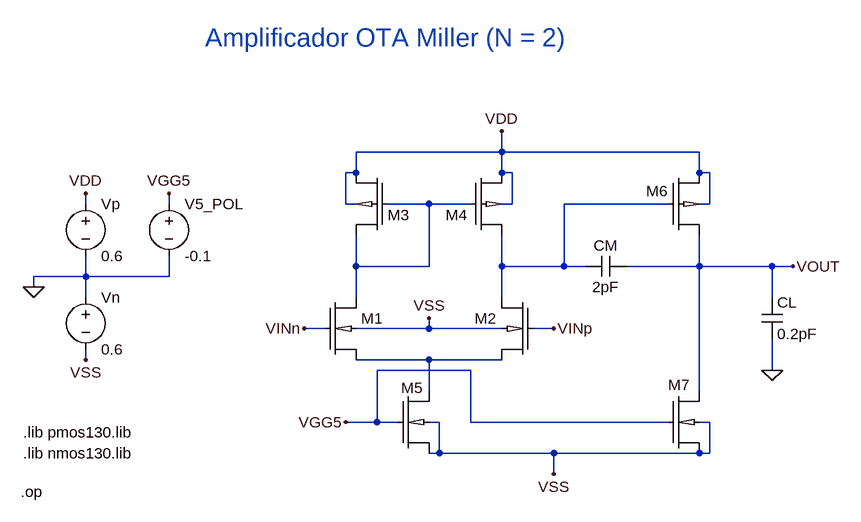
[diagram p0: schematic Amp_OTAMiller_N_2.asc]
Amp_OTAMiller_N_2.asc, the LTspice schematic file:
Version 4.1
SHEET 1 1192 680
WIRE 608 -272 608 -304
WIRE 608 -272 384 -272
WIRE 912 -272 608 -272
WIRE 384 -240 384 -272
WIRE 384 -240 368 -240
WIRE 608 -240 608 -272
WIRE 624 -240 608 -240
WIRE 912 -240 912 -272
WIRE 928 -240 912 -240
WIRE -32 -192 -32 -208
WIRE 96 -192 96 -208
WIRE 368 -192 368 -240
WIRE 384 -192 368 -192
WIRE 496 -192 432 -192
WIRE 560 -192 496 -192
WIRE 624 -192 624 -240
WIRE 624 -192 608 -192
WIRE 864 -192 704 -192
WIRE 928 -192 928 -240
WIRE 928 -192 912 -192
WIRE 384 -96 384 -144
WIRE 496 -96 496 -192
WIRE 496 -96 384 -96
WIRE 608 -96 608 -144
WIRE 704 -96 704 -192
WIRE 704 -96 608 -96
WIRE 736 -96 704 -96
WIRE 912 -96 912 -144
WIRE 912 -96 800 -96
WIRE 1024 -96 912 -96
WIRE 1056 -96 1024 -96
WIRE -32 -80 -32 -112
WIRE -32 -80 -112 -80
WIRE 96 -80 96 -112
WIRE 96 -80 -32 -80
WIRE -112 -64 -112 -80
WIRE -32 -48 -32 -80
WIRE 384 -48 384 -96
WIRE 608 -48 608 -96
WIRE 1024 -48 1024 -96
WIRE 336 0 304 0
WIRE 496 0 496 -16
WIRE 496 0 384 0
WIRE 608 0 496 0
WIRE 688 0 656 0
WIRE -32 48 -32 32
WIRE 496 48 384 48
WIRE 608 48 496 48
WIRE 560 64 416 64
WIRE 1024 64 1024 16
WIRE 496 96 496 48
WIRE 912 96 912 -96
WIRE 416 144 416 64
WIRE 416 144 368 144
WIRE 448 144 416 144
WIRE 512 144 496 144
WIRE 560 144 560 64
WIRE 864 144 560 144
WIRE 928 144 912 144
WIRE 512 192 512 144
WIRE 512 192 496 192
WIRE 688 192 512 192
WIRE 912 192 688 192
WIRE 928 192 928 144
WIRE 928 192 912 192
WIRE 688 224 688 192
FLAG -112 -64 0
FLAG -32 48 VSS
FLAG -32 -208 VDD
FLAG 1024 64 0
FLAG 608 -304 VDD
FLAG 688 224 VSS
FLAG 1056 -96 VOUT
FLAG 688 0 VINp
FLAG 304 0 VINn
FLAG 368 144 VGG5
FLAG 96 -208 VGG5
FLAG 496 -16 VSS
SYMBOL voltage -32 -208 R0
WINDOW 123 0 0 Left 0
WINDOW 39 0 0 Left 0
SYMATTR InstName Vp
SYMATTR Value 0.6
SYMBOL voltage -32 -64 R0
WINDOW 123 0 0 Left 0
WINDOW 39 0 0 Left 0
SYMATTR InstName Vn
SYMATTR Value 0.6
SYMBOL nmos130 336 -48 R0
WINDOW 3 56 72 Invisible 2
SYMATTR InstName M1
SYMATTR SpiceLine width=10u length=2u
SYMBOL nmos130 656 -48 M0
WINDOW 3 56 72 Invisible 2
SYMATTR InstName M2
SYMATTR SpiceLine width=10u length=2u
SYMBOL pmos130 432 -144 R180
WINDOW 0 -34 31 Left 2
WINDOW 3 56 72 Invisible 2
SYMATTR InstName M3
SYMATTR SpiceLine width=20u length=2u
SYMBOL pmos130 560 -144 M180
WINDOW 0 -38 31 Left 2
WINDOW 3 56 72 Invisible 2
SYMATTR InstName M4
SYMATTR SpiceLine width=20u length=2u
SYMBOL nmos130 448 96 R0
WINDOW 0 5 -5 Left 2
WINDOW 3 56 72 Invisible 2
SYMATTR InstName M5
SYMATTR SpiceLine width=1u length=1u
SYMBOL pmos130 864 -144 M180
WINDOW 0 -34 68 Left 2
WINDOW 3 56 72 Invisible 2
SYMATTR InstName M6
SYMATTR SpiceLine width=80u length=500n
SYMBOL nmos130 864 96 R0
WINDOW 0 0 -9 Left 2
WINDOW 3 56 72 Invisible 2
SYMATTR InstName M7
SYMATTR SpiceLine width=40u length=20u
SYMBOL cap 800 -112 R90
WINDOW 0 0 32 VBottom 2
WINDOW 3 32 32 VTop 2
SYMATTR InstName CM
SYMATTR Value 2pF
SYMBOL cap 1008 -48 R0
SYMATTR InstName CL
SYMATTR Value 0.2pF
SYMBOL voltage 96 -208 R0
WINDOW 123 0 0 Left 0
WINDOW 39 0 0 Left 0
SYMATTR InstName V5_POL
SYMATTR Value -0.1
TEXT -128 160 Left 2 !.lib pmos130.lib
TEXT -128 192 Left 2 !.lib nmos130.lib
TEXT 152 -448 Left 4 ;Amplificador OTA Miller (N = 2)
TEXT -132 251 Left 2 !.op

The netlist it stands for:
* Amp_OTAMiller_N_2.asc
Vp VDD 0 0.6
Vn 0 VSS 0.6
X§M1 N001 VINn N003 VSS nmos130 width=10u length=2u  ; pins D G S B
X§M2 N002 VINp N003 VSS nmos130 width=10u length=2u  ; pins D G S B
X§M3 N001 N001 VDD VDD pmos130 width=20u length=2u  ; pins D G S B
X§M4 N002 N001 VDD VDD pmos130 width=20u length=2u  ; pins D G S B
X§M5 N003 VGG5 VSS VSS nmos130 width=1u length=1u  ; pins D G S B
X§M6 VOUT N002 VDD VDD pmos130 width=80u length=500n  ; pins D G S B
X§M7 VOUT VGG5 VSS VSS nmos130 width=40u length=20u  ; pins D G S B
CM VOUT N002 2pF
CL VOUT 0 0.2pF
V5_POL VGG5 0 -0.1
.lib pmos130.lib
.lib nmos130.lib
* Amplificador OTA Miller (N = 2)
.op
.backanno
.end